# EAGLE schematic precharge (EAGLE 9.5.1)
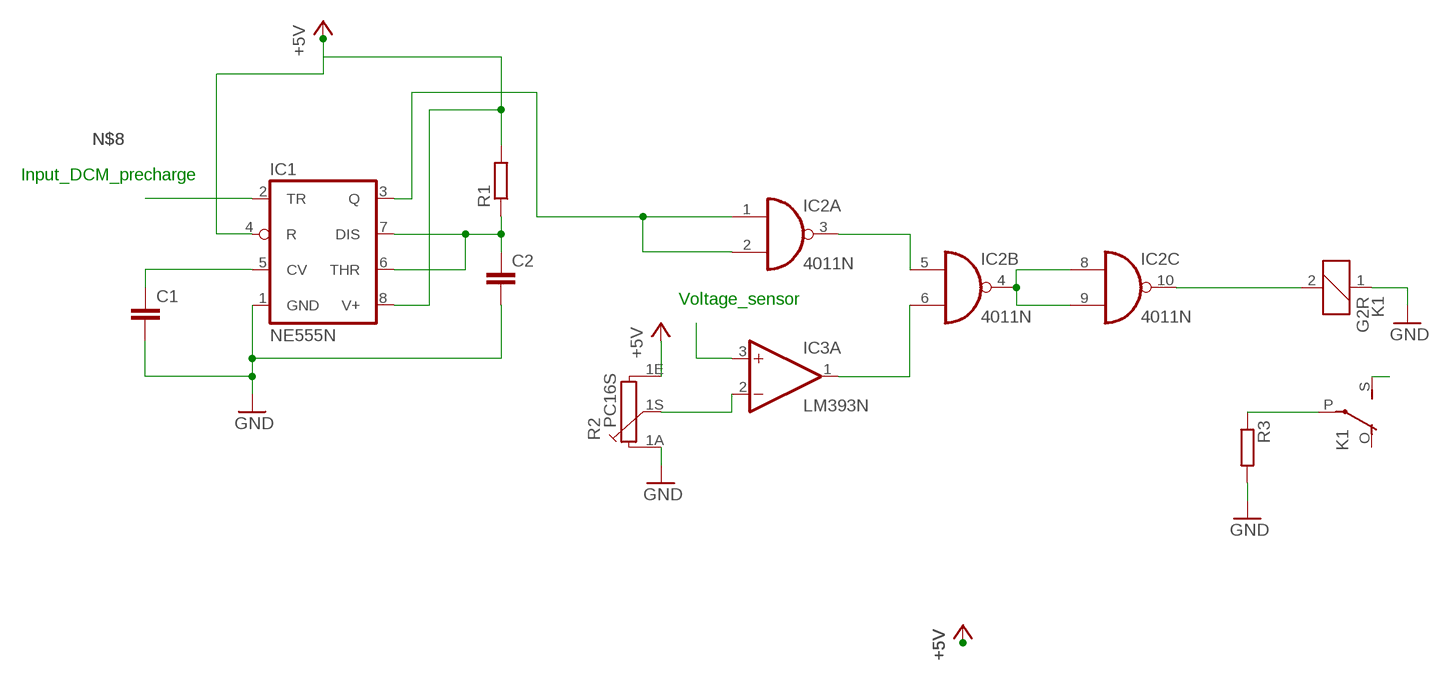
[diagram p0: schematic, sheet 1]

## Parts
C1  C5/3  [C5B3]
C2  C7.5/3  [C7.5B3]
IC1  NE555N  [DIL08]
IC2  4011N  [DIL14]
IC3  LM393N  [DIL08]
K1  G2R  [G2R]
R1  R-EU_0204/7  [0204/7]
R2  PC16S  [PC16S]
R3  R-EU_0207/10  [0207/10]

## Nets
+5V: IC1.4(R) IC1.8(V+) R1.2 R2.1E
GND: C1.2 C2.2 IC1.1(GND) K1.1 R2.1A R3.2
N$1: C1.1 IC1.5(CV)
N$3: K1.S(2:S)
N$4: C2.1 IC1.6(THR) IC1.7(DIS) R1.1
N$5: IC1.3(Q) IC2.1(A:I0) IC2.2(A:I1)
N$8: IC1.2(TR)
N$9: IC2.3(A:O) IC2.5(B:I0)
N$10: IC2.6(B:I1) IC3.1(A:OUT)
N$11: IC2.4(B:O) IC2.8(C:I0) IC2.9(C:I1)
N$12: IC2.10(C:O) K1.2
N$13: K1.P(2:P) R3.1
N$14: IC3.2(A:-IN) R2.1S
N$15: IC3.3(A:+IN)
Unconnected: IC2.11(D:O) IC2.12(D:I0) IC2.13(D:I1) IC3.5(B:+IN) IC3.6(B:-IN) IC3.7(B:OUT) K1.O(2:O)

## Notes on the sheet
- Input_DCM_precharge
- Voltage_sensor

## Power pins joined to a net without a drawn wire
V+: IC3.8(P:V+)
V-: IC3.4(P:V-)
VDD: IC2.14(P:VDD)
VSS: IC2.7(P:VSS)

## Library data of the parts
C1 C2 = capacitor-wima:C: CAPACITOR naming: grid - package width
IC1 = linear:*555: TIMER
IC2 = 40xx:4011: Quad 2-input NAND
IC3 = linear:LM393: COMPARATOR
K1 = relay:G2R: RELAY 1 x switch, Omron; OC_FARNELL: 1569185; OC_NEWARK: unknown
R1 R3 = rcl:R-EU_: RESISTOR, European symbol; SPICEPREFIX: R
R2 = piher:PC16S: POTENTIOMETER single carbon potentiometer, 16 mm, S3ROH; OC_FARNELL: 4452940; OC_NEWARK: unknown